# Altium project tutorial.PrjPCB
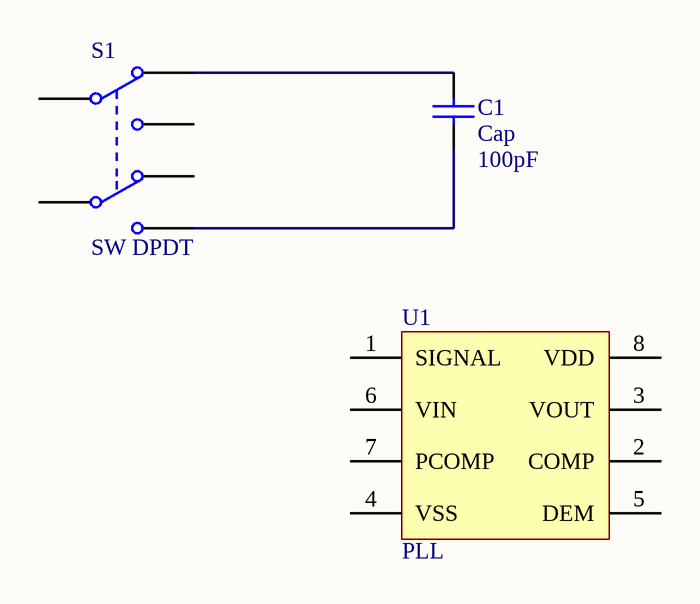
[diagram p0: tutorial.SchDoc]
1 sheet, 3 parts. Net scope: global (net labels, ports and power ports of the same name join across sheets).
Board file: tutorial.PcbDoc

## Sheet tutorial.SchDoc
size A4

### Parts
C1  Cap  value 100pF  [RAD-0.3]
S1  SW DPDT  [SOT23-6_L]
U1  PLL  [TSSOP-8]

### Nets
NetC1_1: C1.1 S1.6(NO2)
NetC1_2: C1.2 S1.2(NC1)

Not connected (* = marked no-connect by the designer): S1 1(COMMON1) 3(NO1) 4(NC2) 5(COMMON2); U1 1(SIGNAL) 2(COMP) 3(VOUT) 4(VSS) 5(DEM) 6(VIN) 7(PCOMP) 8(VDD)

### Library data of the parts
C1 = Cap: Capacitor; Published: 8-Jun-2000; LatestRevisionDate: 17-Jul-2002; LatestRevisionNote: Re-released for DXP Platform.; PackageReference: RAD-0.3; Publisher: Altium Limited; PackageDescription: Radial Cap, Thru-Hole; 2 Leads; 0.3 in Pin Spacing
S1 = SW DPDT: Switch; Published: 24-Mar-1999; LatestRevisionDate: 29-May-2009; LatestRevisionNote: IPC-7351 Footprint Added.; PackageVersion: Mar-2001; PackageReference: SOT23-6; Publisher: Altium Limited; PackageDescription: 6-Pin SOT-23 Package 0.95 mm Pitch, 2.7 mm Lead Span; Code_JEITA: SC-74; Code_IPC: SOT26A-6
U1 = PLL: Generic Phase Locked Loop; Published: 8-Jun-2000; LatestRevisionDate: 29-May-2009; LatestRevisionNote: IPC-7351 Footprint Added.; PackageVersion: May-1999; PackageReference: DB008; Publisher: Altium Limited; PackageDescription: 8-Pin Plastic Small Outline Package 0.65 mm Pitch; Code_JEDEC: MO-150-AA; Code_IPC: SOP65P780-8